# EasyEDA Pro project smart-switch-v2.eprj, board main-board
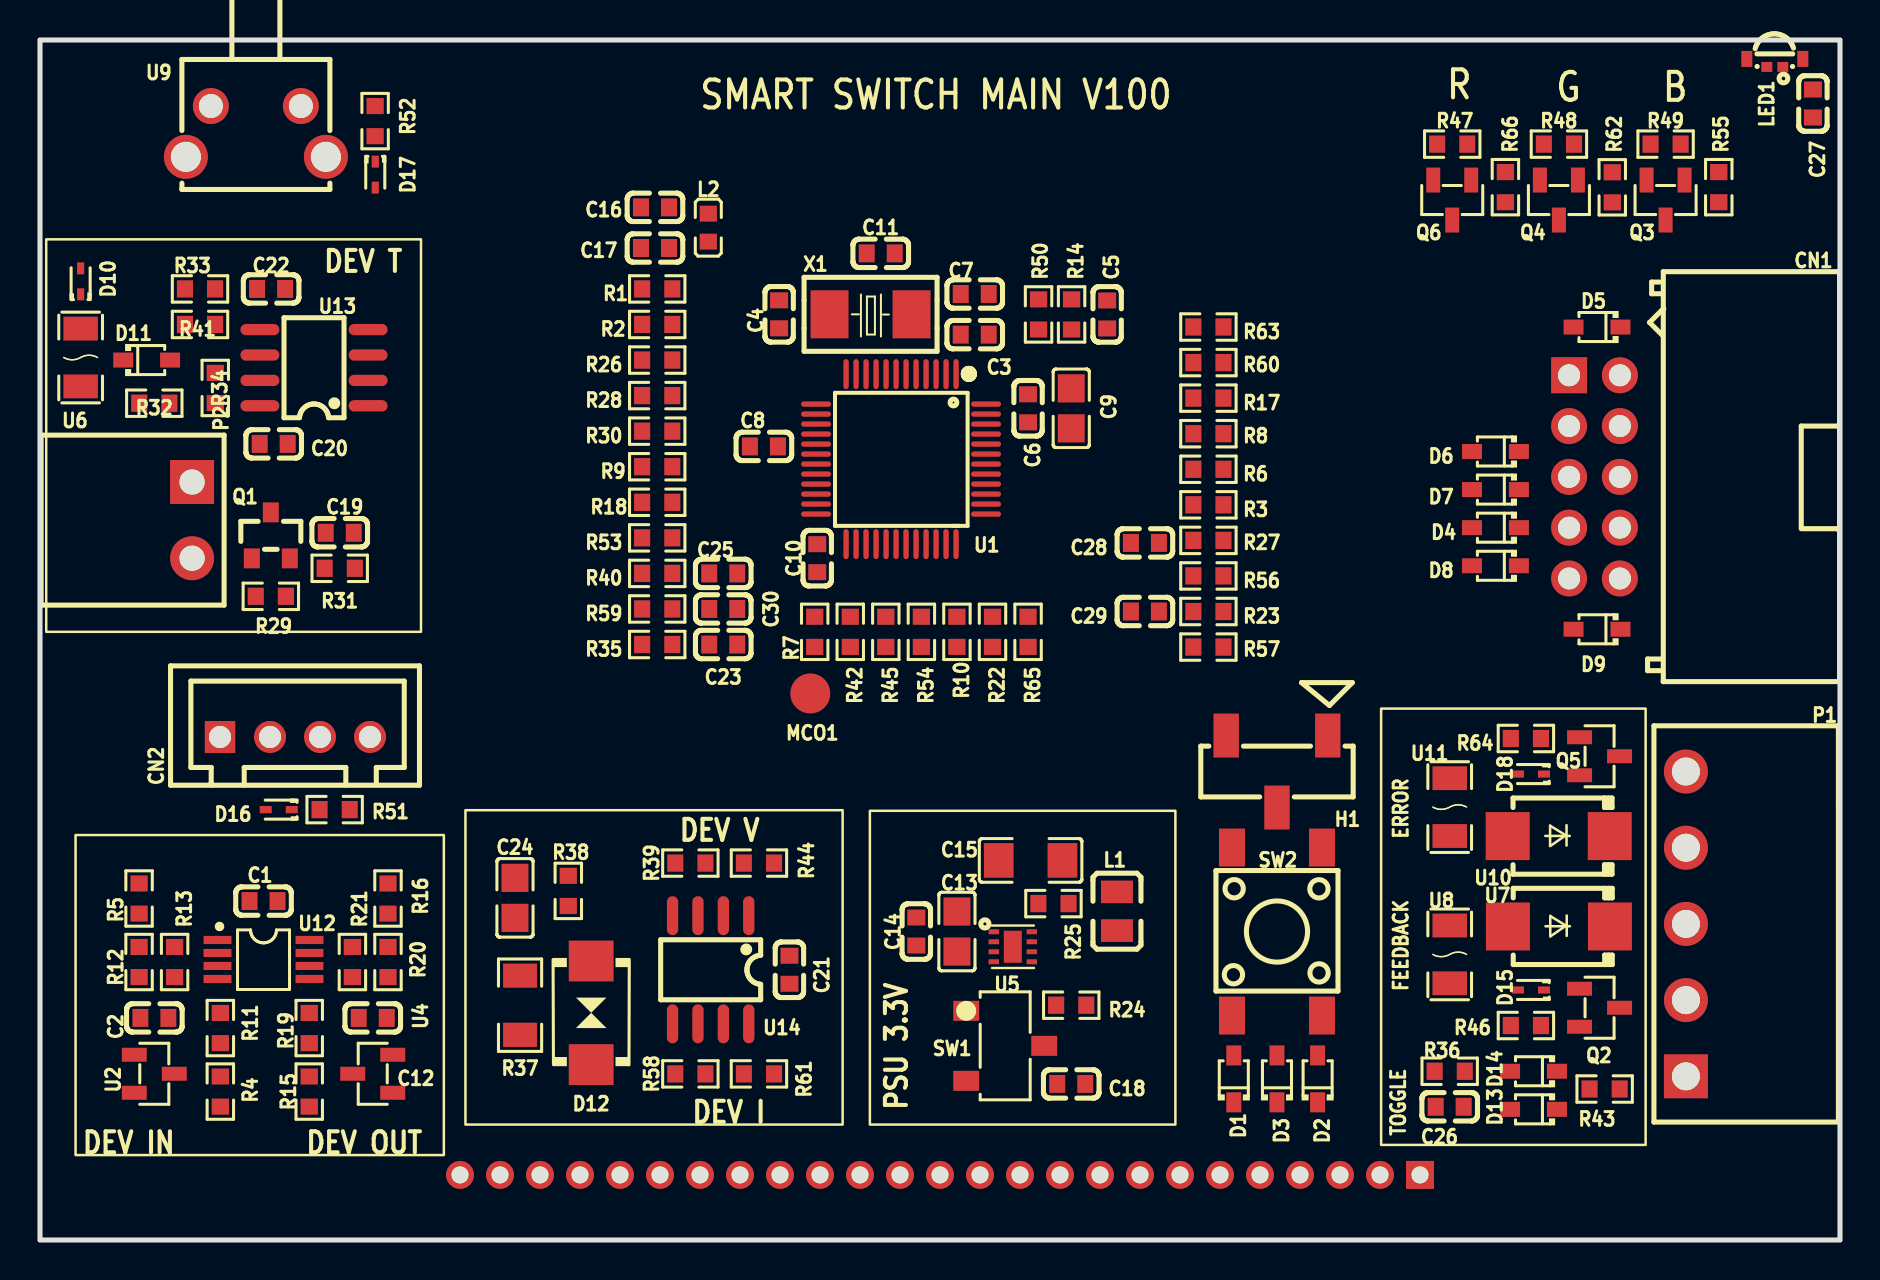
[diagram p3: board, top side]
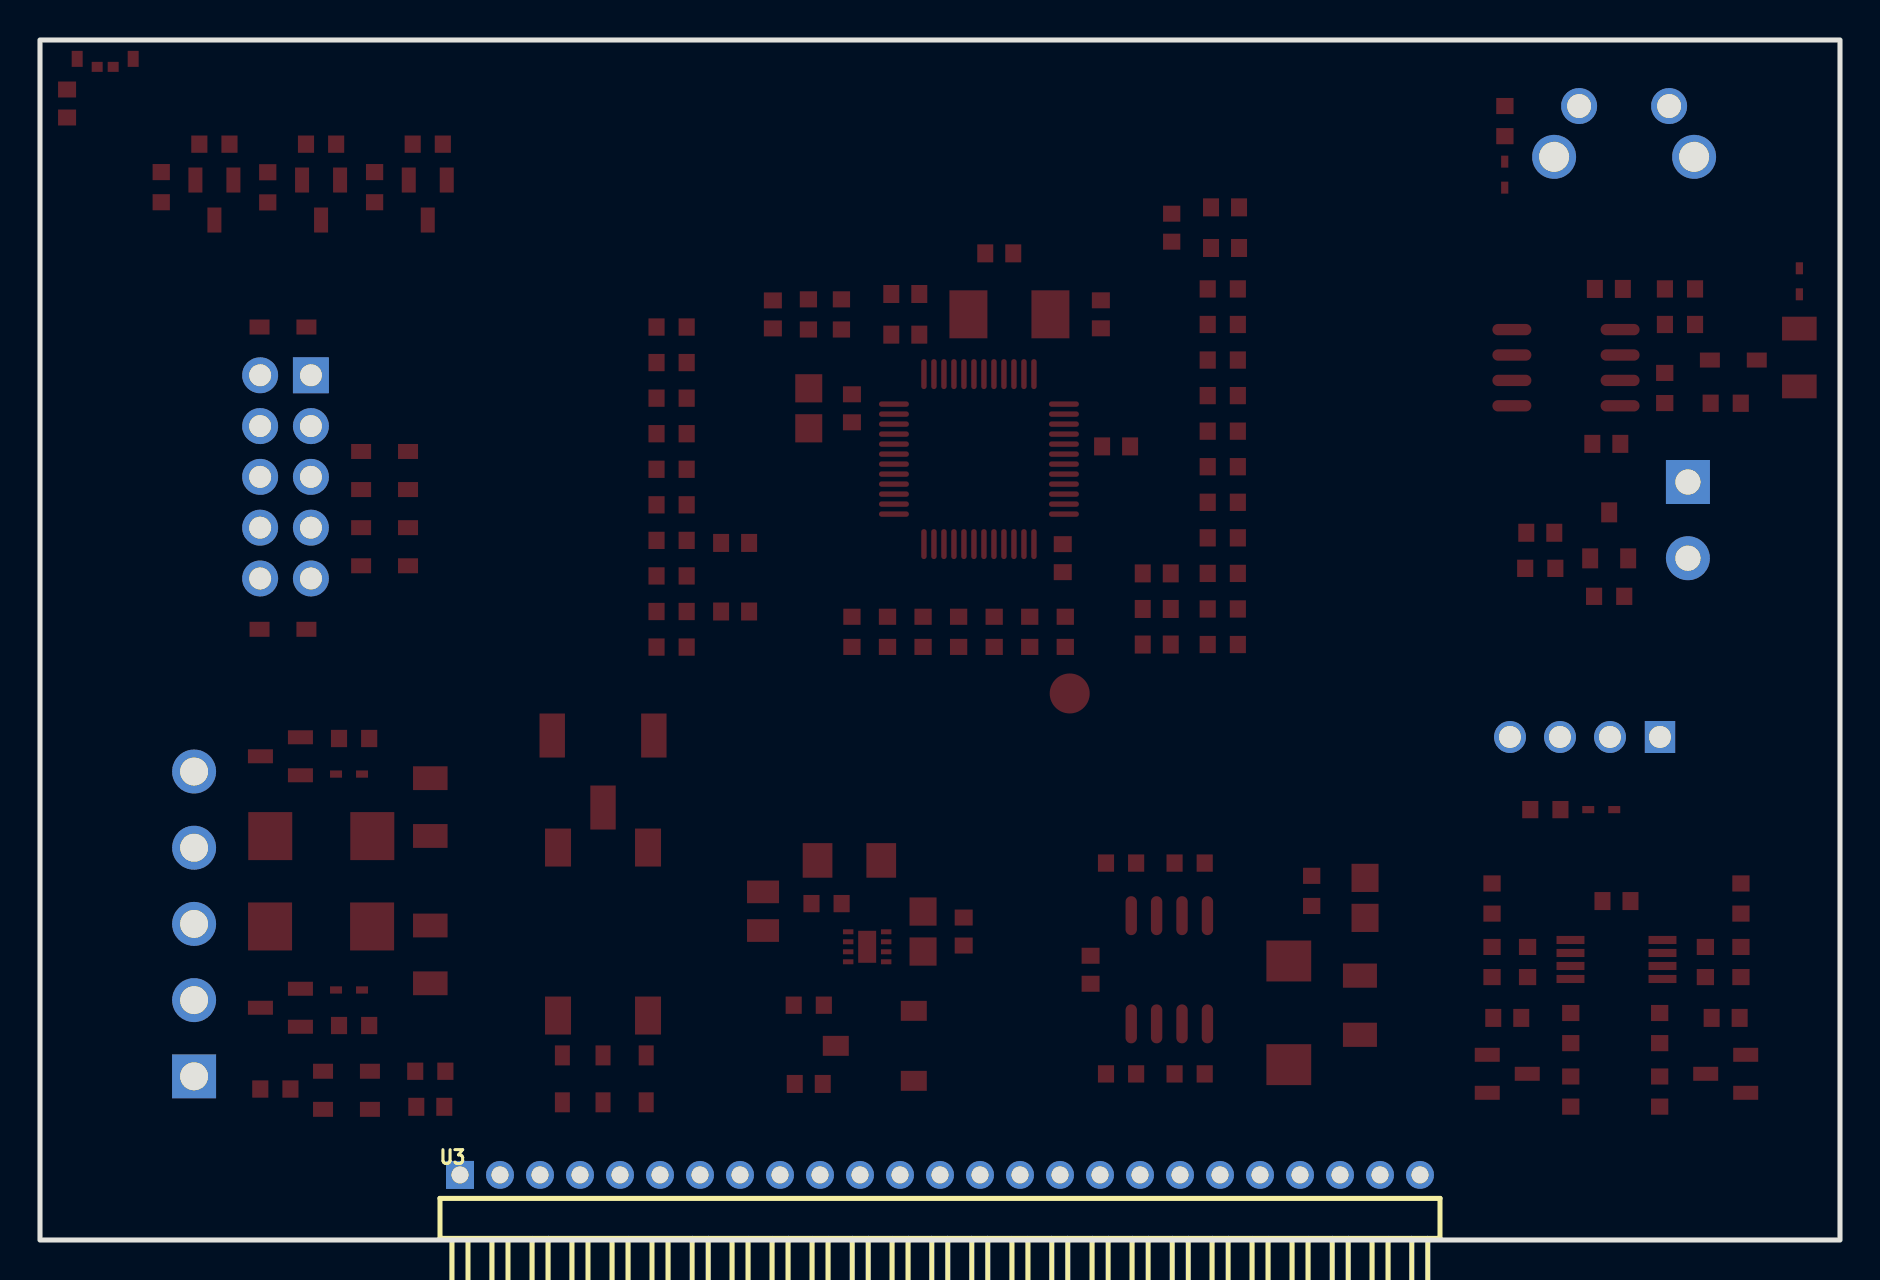
[diagram p4: board, bottom side, seen from below]

Outline 90 x 60 mm; copper layers: Top Layer, Bottom Layer. Coordinates in mm from the lower left corner of the outline.
Outline path: rectangle 0,60 90,0
Stack: Top Layer 0.035mm / Dielectric1 1.51mm FR4 er 4.5 / Bottom Layer 0.035mm

## Design rules (mm)
template: JLCPCB Capability(Two Layers Board)
spacing copperThickness1oz (default): track to track 0.102, other pairs 0.152 to 0.3
spacing copperThickness2oz: track to track 0.203, other pairs 0.152 to 0.3
track width copperThickness1oz (default): min 0.127, default 0.254, max 2.54
track width copperThickness2oz: min 0.203, default 0.254, max 2.54
differential pair differentialPair (default): width min 0.127, default 0.254, max 2.54; gap min 0.152, default 0.152
via viaSize (default): diameter min 0.5, default 0.61, max 10; hole min 0.3, default 0.305, max 6.3

## Placement (name value [footprint] x y rotation side)
C1  100nF  [C0603]  11.18 16.95 180 top
C2  2.2nF  [C0603]  5.72 11.1 0 top
C3  33pF  [C0603]  46.74 47.3 180 top
C4  33pF  [C0603]  36.96 46.28 270 top
C5  100nF  [C0603]  53.36 46.28 90 top
C6  4.7uF  [C0805]  51.56 41.58 90 top
C7  100nF  [C0603]  46.74 45.27 0 top
C8  100nF  [C0603]  36.19 39.68 180 top
C9  100nF  [C0603]  49.4 41.58 270 top
C10  100nF  [C0603]  38.86 34.09 270 top
C11  100nF  [C0603]  42.04 49.33 0 top
C12  2.2nF  [C0603]  16.64 11.1 180 top
C13  10uF  [C0805]  45.85 15.42 90 top
C14  100nF  [C0603]  43.81 15.42 90 top
C15  22uF  [C1206]  49.53 18.98 180 top
C16  100nF  [C0603]  30.75 51.63 0 top
C17  100nF  [C0603]  30.75 49.6 0 top
C18  100nF  [C0603]  51.56 7.8 0 top
C19  100nF  [C0603]  14.99 35.36 0 top
C20  100nF  [C0603]  11.68 39.81 0 top
C21  100nF  [C0603]  37.47 13.51 90 top
C22  1nF  [C0603]  11.56 47.55 0 top
C23  100nF  [C0603]  34.16 29.77 0 top
C24  100nF  [C0805]  23.75 17.11 90 top
C25  22nF  [C0603]  34.16 33.33 180 top
C26  100nF  [C0603]  70.49 6.66 0 top
C27  100nF  [C0603]  88.65 56.83 270 top
C28  100nF  [C0603]  55.25 34.85 0 top
C29  100nF  [C0603]  55.25 31.42 0 top
C30  22nF  [C0603]  34.16 31.55 180 top
CN1  X9555WR-2x05-6TV01  [IDC-TH_10P-P2.54-H-R2-C5-S2.54]  77.72 38.16 90 top
CN2  ZX-XH2.54-4PZZ  [CONN-TH_4P-P2.50_4PIN]  12.75 25.15 0 top
D1  PESD5V0U1UA,115  [SOD-323_L1.8-W1.3-LS2.5-RD]  59.69 8.06 90 top
D2  PESD5V0U1UA,115  [SOD-323_L1.8-W1.3-LS2.5-RD]  63.88 8.06 90 top
D3  PESD5V0U1UA,115  [SOD-323_L1.8-W1.3-LS2.5-RD]  61.85 8.06 90 top
D4  PESD5V0U1UA,115  [SOD-323_L1.8-W1.3-LS2.5-RD]  72.77 35.62 180 top
D5  PESD5V0U1UA,115  [SOD-323_L1.8-W1.3-LS2.5-RD]  77.85 45.65 180 top
D6  PESD5V0U1UA,115  [SOD-323_L1.8-W1.3-LS2.5-RD]  72.77 39.43 180 top
D7  PESD5V0U1UA,115  [SOD-323_L1.8-W1.3-LS2.5-RD]  72.77 37.52 180 top
D8  PESD5V0U1UA,115  [SOD-323_L1.8-W1.3-LS2.5-RD]  72.77 33.71 180 top
D9  PESD5V0U1UA,115  [SOD-323_L1.8-W1.3-LS2.5-RD]  77.85 30.54 180 top
D10  PESD3V3S1UB,115  [SOD-523_L1.2-W0.8-LS1.6-RD]  2.03 47.94 90 top
D11  BAT54WS-7-F  [SOD-323_L1.8-W1.3-LS2.5-RD]  5.33 44 0 top
D12  SMBJ28CA  [SMB_L4.6-W3.6-LS5.3-BI]  27.56 11.36 90 top
D13  PESD5V0U1UA,115  [SOD-323_L1.8-W1.3-LS2.5-RD]  74.68 6.53 180 top
D14  BAT54WS-7-F  [SOD-323_L1.8-W1.3-LS2.5-RD]  74.68 8.44 180 top
D15  PESD3V3S1UB,115  [SOD-523_L1.2-W0.8-LS1.6-RD]  74.55 12.5 180 top
D16  PESD3V3S1UB,115  [SOD-523_L1.2-W0.8-LS1.6-RD]  11.94 21.52 180 top
D17  PESD3V3S1UB,115  [SOD-523_L1.2-W0.8-LS1.6-RD]  16.76 53.27 270 top
D18  PESD3V3S1UB,115  [SOD-523_L1.2-W0.8-LS1.6-RD]  74.55 23.3 180 top
H1  X6511WVS-03H-C60D48R2  [HDR-SMD_3P-P2.54_XKB_X6511WVS-03H-C60D48R2]  61.85 23.42 180 top
L1  2.2uH  [IND-SMD_L2.0-W1.6-1]  53.85 16.44 90 top
L2  BLM18KG601SN1D  [L0603]  33.42 50.62 270 top
LED1  MHS110RGBCT  [LED-ARRAY-SMD_MHS110RGBCT]  86.74 58.86 0 top
MCO1  -  [Test-Point-0.5mm]  38.51 27.33 90 top
P1  WJ15EDGRC-3.81-5P  [CONN-TH_5P-P3.81_WJ15EDGRC-3.81-5P]  82.3 15.8 90 top
P2  WJ15EDGRC-3.81-2P  [CONN-TH_2P-P3.81_WJ15EDGRC-3.81-2P]  7.6 35.99 270 top
Q1  AO3401A  [SOT-23_L2.9-W1.3-P1.90-LS2.4-BR]  11.54 35.23 270 top
Q2  AO3400A  [SOT-23-3_L2.9-W1.3-P1.90-LS2.4-BR]  77.98 11.61 180 top
Q3  2N7002  [SOT-23-3_L2.9-W1.3-P1.90-LS2.4-BR]  81.28 52 90 top
Q4  2N7002  [SOT-23-3_L2.9-W1.3-P1.90-LS2.4-BR]  75.95 52 90 top
Q5  AO3400A  [SOT-23-3_L2.9-W1.3-P1.90-LS2.4-BR]  77.98 24.19 180 top
Q6  2N7002  [SOT-23-3_L2.9-W1.3-P1.90-LS2.4-BR]  70.61 52 90 top
R1  47Ω  [R0603]  30.86 47.55 0 top
R2  47Ω  [R0603]  30.86 45.78 0 top
R3  47Ω  [R0603]  58.42 36.76 180 top
R4  3.3MΩ  [R0603]  9.02 7.42 270 top
R5  1.8MΩ  [R0603]  4.95 17.07 90 top
R6  47Ω  [R0603]  58.42 38.54 180 top
R7  47Ω  [R0603]  38.74 30.41 90 top
R8  47Ω  [R0603]  58.42 40.31 180 top
R9  1kΩ  [R0603]  30.86 38.66 0 top
R10  47Ω  [R0603]  45.85 30.41 90 top
R11  430kΩ  [R0603]  9.02 10.6 270 top
R12  680kΩ  [R0603]  4.95 13.9 90 top
R13  10MΩ  [R0603]  6.73 13.9 270 top
R14  220Ω  [R0603]  51.58 46.28 270 top
R15  3.3MΩ  [R0603]  13.46 7.42 270 top
R16  1.8MΩ  [R0603]  17.4 17.07 90 top
R17  10kΩ  [R0603]  58.42 42.09 180 top
R18  1kΩ  [R0603]  30.86 36.89 0 top
R19  430kΩ  [R0603]  13.46 10.6 270 top
R20  680kΩ  [R0603]  17.4 13.9 90 top
R21  10MΩ  [R0603]  15.62 13.9 270 top
R22  47Ω  [R0603]  47.62 30.41 270 top
R23  47Ω  [R0603]  58.42 29.65 0 top
R24  100kΩ  [R0603]  51.56 11.74 0 top
R25  100kΩ  [R0603]  50.67 16.82 0 top
R26  100Ω  [R0603]  30.86 44 180 top
R27  100Ω  [R0603]  58.42 33.2 0 top
R28  100Ω  [R0603]  30.86 42.22 180 top
R29  100kΩ  [R0603]  11.54 32.18 0 top
R30  100Ω  [R0603]  30.86 40.44 180 top
R31  470kΩ  [R0603]  14.99 33.58 0 top
R32  10kΩ  [R0603]  5.72 41.84 0 top
R33  4.7kΩ  [R0603]  8 47.55 180 top
R34  220kΩ  [R0603]  8.76 42.6 270 top
R35  1kΩ  [R0603]  30.86 29.77 180 top
R36  100kΩ  [R0603]  70.49 8.44 180 top
R37  100Ω  [R1206]  24 11.74 90 top
R38  1kΩ  [R0603]  26.42 17.45 90 top
R39  270kΩ  [R0603]  32.52 18.85 0 top
R40  220Ω  [R0603]  30.86 33.33 180 top
R41  270kΩ  [R0603]  8 45.78 0 top
R42  4.7kΩ  [R0603]  40.51 30.41 90 top
R43  22kΩ  [R0603]  78.23 7.55 180 top
R44  30kΩ  [R0603]  35.95 18.85 180 top
R45  1kΩ  [R0603]  42.29 30.41 270 top
R46  100kΩ  [R0603]  74.29 10.72 180 top
R47  120Ω  [R0603]  70.61 54.79 0 top
R48  100Ω  [R0603]  75.95 54.79 0 top
R49  100Ω  [R0603]  81.28 54.79 180 top
R50  10kΩ  [R0603]  49.93 46.28 270 top
R51  10kΩ  [R0603]  14.73 21.52 0 top
R52  10kΩ  [R0603]  16.76 55.94 90 top
R53  820Ω  [R0603]  30.86 35.11 0 top
R54  100Ω  [R0603]  44.07 30.41 90 top
R55  100kΩ  [R0603]  83.94 52.64 270 top
R56  1kΩ  [R0603]  58.42 34.98 180 top
R57  1kΩ  [R0603]  58.42 31.42 180 top
R58  100kΩ  [R0603]  32.52 8.31 0 top
R59  220Ω  [R0603]  30.86 31.55 180 top
R60  100Ω  [R0603]  58.42 43.87 0 top
R61  56kΩ  [R0603]  35.95 8.31 180 top
R62  100kΩ  [R0603]  78.61 52.63 270 top
R63  1kΩ  [R0603]  58.42 45.65 0 top
R64  100kΩ  [R0603]  74.29 25.08 180 top
R65  100Ω  [R0603]  49.4 30.41 270 top
R66  100kΩ  [R0603]  73.27 52.64 270 top
SW1  CAS-120B1  [SW-SMD_NIDEC_CAS-120B1]  48.26 9.71 270 top
SW2  TS-1002S-05026C  [KEY-SMD_4P-L6.0-W6.0-P4.50-LS9.0]  61.85 15.42 270 top
U1  STM32F373CCT6  [LQFP-48_L7.0-W7.0-P0.50-LS9.0-BL]  43.05 39.05 180 top
U2  BAV199  [SOT-23-3_L2.9-W1.3-P0.95-LS2.4-BR]  5.72 8.31 180 top
U3  KH-2PH90-1X25P-L10.5  [HDR-TH_25P-P2.00-H-M-W7.5-N]  45 3.25 180 bottom
U4  BAV199  [SOT-23-3_L2.9-W1.3-P0.95-LS2.4-BR]  16.64 8.31 0 top
U5  TPS62162DSGR  [WSON-8_L2.0-W2.0-P0.50-TL-EP]  48.64 14.66 0 top
U6  JK-nSMD005/60V  [F1206]  2.03 44.12 90 top
U7  SMBJ18A  [SMB_L4.5-W3.6-LS5.4-RD]  75.95 15.68 180 top
U8  JK-nSMD005/60V  [F1206]  70.49 14.28 90 top
U9  TC-6615-9.0-160G  [KEY-TH_PTS645VXX83XLFS]  10.8 55.43 180 top
U10  SMBJ18A  [SMB_L4.5-W3.6-LS5.4-RD]  75.94 20.19 180 top
U11  JK-nSMD005/60V  [F1206]  70.49 21.65 270 top
U12  RS8905XM  [MSOP-8_L3.0-W3.0-P0.65-LS4.9-BL]  11.18 14.03 270 top
U13  TLV9062IDR  [SOIC-8_L5.0-W4.0-P1.27-LS6.0-BL]  13.7 43.61 90 top
U14  TLV9062IDR  [SOIC-8_L5.0-W4.0-P1.27-LS6.0-BL]  33.53 13.51 180 top
X1  8MHz  [CRYSTAL-SMD_L5.0-W3.2]  41.53 46.28 0 top

## Footprints (pads in the part's own frame, mm; a bottom-side part is the same pattern mirrored in y, then rotated)
C0603
  rect 0.8x0.9 smd: 1(-0.7,0) 2(0.7,0)
C0805
  rect 1.41x1.35 smd: 1(-1,0) 2(1,0)
C1206
  rect 1.485x1.728 smd: 1(-1.593,0) 2(1.593,0)
CONN-TH_2P-P3.81_WJ15EDGRC-3.81-2P
  rect 2.2x2.2 hole 1.26: 1(-1.905,0)
  round 2.2 hole 1.26: 2(1.905,0)
CONN-TH_4P-P2.50_4PIN
  rect 1.524x1.6 hole 1.1: 1(-3.75,0)
  round 1.6 hole 1.1: 2(-1.25,0) 3(1.25,0) 4(3.75,0)
CONN-TH_5P-P3.81_WJ15EDGRC-3.81-5P
  rect 2.2x2.2 hole 1.4: 1(-7.62,0)
  round 2.2 hole 1.4: 2(-3.81,0) 3(0,0) 4(3.81,0) 5(7.62,0)
CRYSTAL-SMD_L5.0-W3.2
  rect 1.9x2.4 smd: 1(-2.05,0) 2(2.05,0)
F1206
  rect 1.19x1.728 smd: 1(-1.445,0) 2(1.445,0)
HDR-SMD_3P-P2.54_XKB_X6511WVS-03H-C60D48R2
  rect 1.27x2.2 smd: 1(-2.54,-1.8) 2(0,1.8) 3(2.54,-1.8)
HDR-TH_25P-P2.00-H-M-W7.5-N
  rect 1.4x1.4 hole 0.85: 1(-24,0)
  round 1.4 hole 0.85: 2(-22,0) 3(-20,0) 4(-18,0) 5(-16,0) 6(-14,0) 7(-12,0) 8(-10,0) 9(-8,0) 10(-6,0) 11(-4,0) 12(-2,0) 13(0,0) 14(2,0) 15(4,0) 16(6,0) 17(8,0) 18(10,0) 19(12,0) 20(14,0) 21(16,0) 22(18,0) 23(20,0) 24(22,0) 25(24,0)
IDC-TH_10P-P2.54-H-R2-C5-S2.54
  rect 1.8x1.8 hole 1.1: 1(5.08,1.27)
  round 1.8 hole 1.1: 2(5.08,-1.27) 3(2.54,1.27) 4(2.54,-1.27) 5(0,1.27) 6(0,-1.27) 7(-2.54,1.27) 8(-2.54,-1.27) 9(-5.08,1.27) 10(-5.08,-1.27)
IND-SMD_L2.0-W1.6-1
  rect 1.133x1.6 smd: 1(-0.967,0) 2(0.967,0)
KEY-SMD_4P-L6.0-W6.0-P4.50-LS9.0
  rect 1.9x1.3 smd: 1(-4.2,2.25) 2(4.2,2.25) 3(-4.2,-2.25) 4(4.2,-2.25)
KEY-TH_PTS645VXX83XLFS
  round 1.8 hole 1.2: 1(-2.25,-1.27) 2(2.25,-1.27)
  round 2.2 hole 1.5: 3(-3.5,1.27) 4(3.5,1.27)
L0603
  rect 0.8x0.864 smd: 1(-0.7,0) 2(0.7,0)
LED-ARRAY-SMD_MHS110RGBCT
  rect 0.55x0.5 smd: 1(0.4,-0.2) 4(-0.4,-0.2)
  rect 0.55x0.8 smd: 2(1.4,0.2) 3(-1.4,0.2)
LQFP-48_L7.0-W7.0-P0.50-LS9.0-BL
  oval 0.27x1.5 smd: 1(-2.75,-4.25) 2(-2.25,-4.25) 3(-1.75,-4.25) 4(-1.25,-4.25) 5(-0.75,-4.25) 6(-0.25,-4.25) 7(0.25,-4.25) 8(0.75,-4.25) 9(1.25,-4.25) 10(1.75,-4.25) 11(2.25,-4.25) 12(2.75,-4.25) 25(2.75,4.25) 26(2.25,4.25) 27(1.75,4.25) 28(1.25,4.25) 29(0.75,4.25) 30(0.25,4.25) 31(-0.25,4.25) 32(-0.75,4.25) 33(-1.25,4.25) 34(-1.75,4.25) 35(-2.25,4.25) 36(-2.75,4.25)
  oval 1.5x0.27 smd: 13(4.25,-2.75) 14(4.25,-2.25) 15(4.25,-1.75) 16(4.25,-1.25) 17(4.25,-0.75) 18(4.25,-0.25) 19(4.25,0.25) 20(4.25,0.75) 21(4.25,1.25) 22(4.25,1.75) 23(4.25,2.25) 24(4.25,2.75) 37(-4.25,2.75) 38(-4.25,2.25) 39(-4.25,1.75) 40(-4.25,1.25) 41(-4.25,0.75) 42(-4.25,0.25) 43(-4.25,-0.25) 44(-4.25,-0.75) 45(-4.25,-1.25) 46(-4.25,-1.75) 47(-4.25,-2.25) 48(-4.25,-2.75)
MSOP-8_L3.0-W3.0-P0.65-LS4.9-BL
  rect 0.406x1.397 smd: 1(-0.975,-2.3) 2(-0.325,-2.3) 3(0.325,-2.3) 4(0.975,-2.3) 5(0.975,2.3) 6(0.325,2.3) 7(-0.325,2.3) 8(-0.975,2.3)
R0603
  rect 0.806x0.864 smd: 1(-0.753,0) 2(0.753,0)
R1206
  rect 1.208x1.701 smd: 1(-1.479,0) 2(1.479,0)
SMB_L4.5-W3.6-LS5.4-RD
  rect 2.2x2.4 smd: 1(-2.551,0) 2(2.551,0)
SMB_L4.6-W3.6-LS5.3-BI
  rect 2.047x2.241 smd: 1(-2.591,0) 2(2.591,0)
SOD-323_L1.8-W1.3-LS2.5-RD
  rect 1x0.75 smd: 1(-1.173,0) 2(1.173,0)
SOD-523_L1.2-W0.8-LS1.6-RD
  rect 0.6x0.36 smd: 1(-0.65,0) 2(0.65,0)
SOIC-8_L5.0-W4.0-P1.27-LS6.0-BL
  oval 0.569x1.95 smd: 1(-1.905,-2.705) 2(-0.635,-2.705) 3(0.635,-2.705) 4(1.905,-2.705) 5(1.905,2.705) 6(0.635,2.705) 7(-0.635,2.705) 8(-1.905,2.705)
SOT-23-3_L2.9-W1.3-P0.95-LS2.4-BR
  rect 1.25x0.7 smd: 1(1,-0.95) 2(1,0.95) 3(-1,0)
SOT-23-3_L2.9-W1.3-P1.90-LS2.4-BR
  rect 1.25x0.7 smd: 1(1,-0.95) 2(1,0.95) 3(-1,0)
SOT-23_L2.9-W1.3-P1.90-LS2.4-BR
  rect 1x0.8 smd: 1(1.15,-0.95) 2(1.15,0.95) 3(-1.15,0)
SW-SMD_NIDEC_CAS-120B1
  rect 1x1.3 smd: 1(-1.75,-1.95) 2(0,1.95) 3(1.75,-1.95)
Test-Point-0.5mm
  round 2 smd: 1(0,0)
WSON-8_L2.0-W2.0-P0.50-TL-EP
  rect 0.521x0.25 smd: 1(-0.95,0.75) 2(-0.95,0.25) 3(-0.95,-0.25) 4(-0.95,-0.75) 5(0.95,-0.75) 6(0.95,-0.25) 7(0.95,0.25) 8(0.95,0.75)
  rect 0.9x1.6 smd: 9(0,0)

## Nets
As in the schematic.

Pads without a net: U1 2 3 4 21 26 27 28 36; U3 21; U9 3 4

## Text on the board
Top Silkscreen Layer: TOGGLE | ERROR | FEEDBACK | DEV IN | DEV OUT | DEV V | DEV I | PSU 3.3V | DEV T | SMART SWITCH MAIN V100 | R | G | B
